# Altium schematic sheet RPI.SchDoc
size A
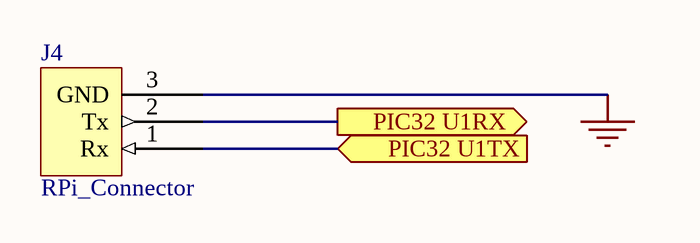
[diagram p0: RPI.SchDoc]

## Parts
J4  RPi_Connector  [RPI CONNECTOR]

## Ports
PIC32 U1RX (out), PIC32 U1TX (in)

## Nets
GND: J4.3(GND)
PIC32 U1RX: J4.2(Tx) ; port PIC32 U1RX
PIC32 U1TX: J4.1(Rx) ; port PIC32 U1TX

## Library data of the parts
J4 = RPi_Connector: Female Embase 3 contacts; fournisseur: Farnell; reffournisseur: 1845931; fabricant: TE CONNECTIVITY / AMP; reffabricant: 5-534237-1